# EAGLE design BCB-RECIEVER-DESGIN (EAGLE 9.3.1)
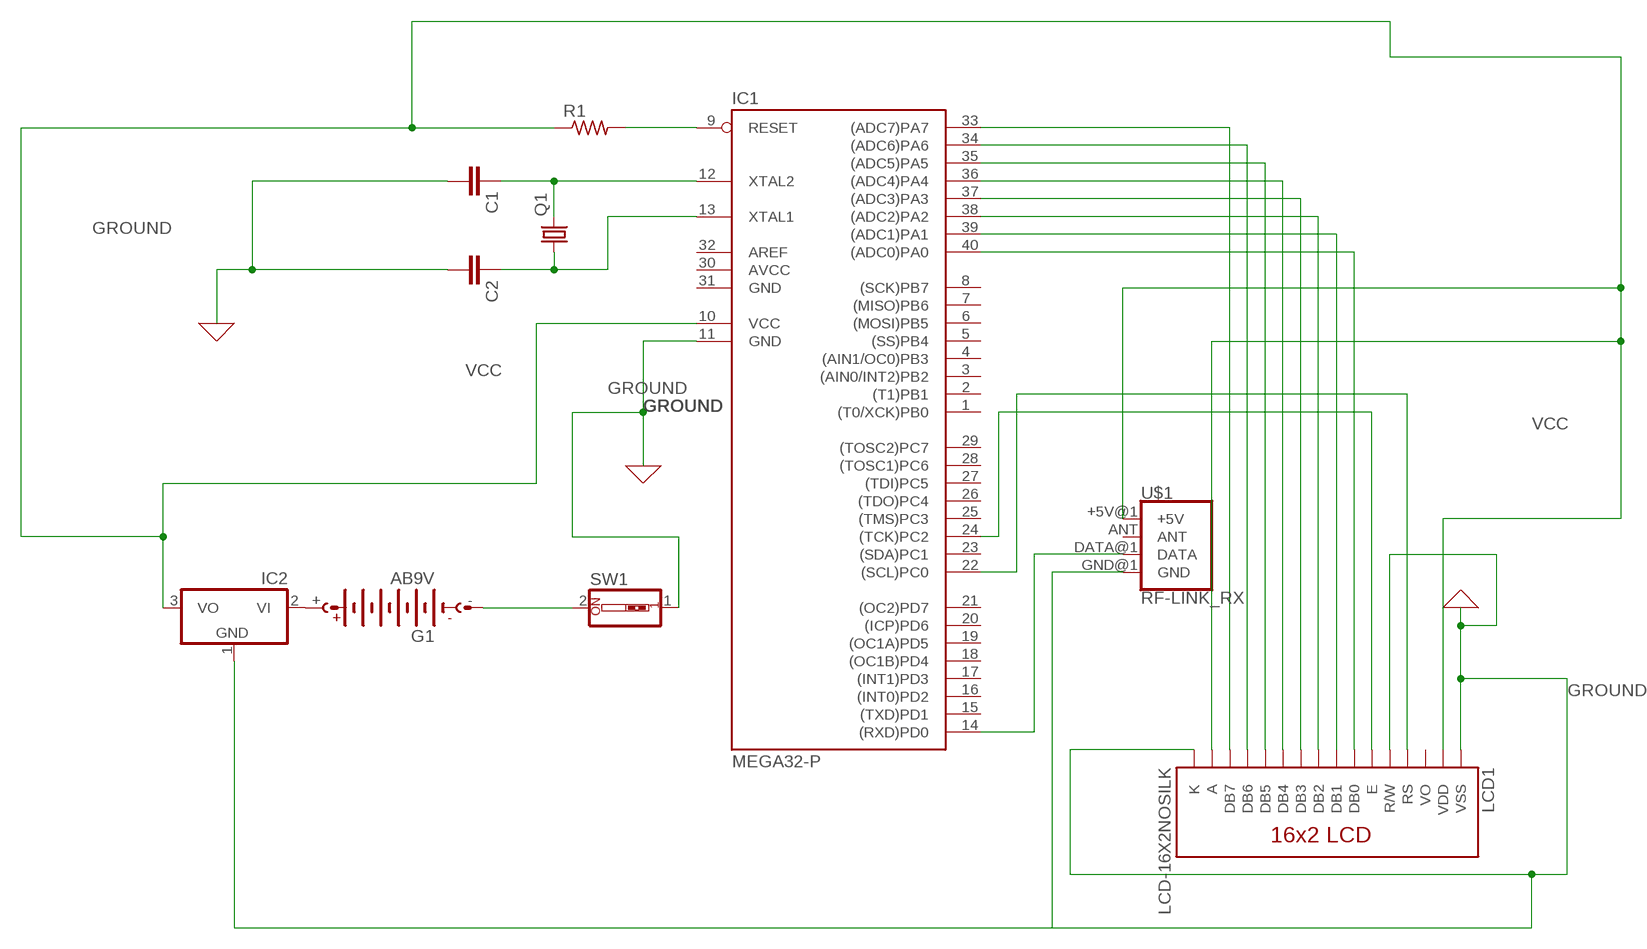
[diagram p0: schematic, sheet 1]

## Parts
C1  C5/2.5  [C5B2.5]
C2  C5/2.5  [C5B2.5]
G1  AB9V  [AB9V]
IC1  MEGA32-P  [DIL40]
IC2  7905T  [TO220H]
LCD1  LCD-16X2NOSILK  [LCD-16X2_NOSILK]
Q1  CRYSTALHC49S  [HC49/S]
R1  R-US_0207/10  [0207/10]
SW1  SW_DIP-1  [EDG-01]
U$1  RF-LINK_RX  [RF-LINK_RX]

## Nets
GROUND: C1.2 C2.2 IC1.11(GND) IC2.1(GND) LCD1.1(VSS) LCD1.5(R/W) LCD1.16(K) SW1.1 U$1.GND@1(GND) ; supply symbol labelled GND
N$1: IC1.9(RESET) R1.2
N$2: IC1.33((ADC7)PA7) LCD1.14(DB7)
N$3: IC1.34((ADC6)PA6) LCD1.13(DB6)
N$4: IC1.35((ADC5)PA5) LCD1.12(DB5)
N$5: IC1.36((ADC4)PA4) LCD1.11(DB4)
N$6: IC1.37((ADC3)PA3) LCD1.10(DB3)
N$7: IC1.38((ADC2)PA2) LCD1.9(DB2)
N$8: IC1.39((ADC1)PA1) LCD1.8(DB1)
N$9: IC1.40((ADC0)PA0) LCD1.7(DB0)
N$10: IC1.22((SCL)PC0) LCD1.4(RS)
N$11: IC1.24((TCK)PC2) LCD1.6(E)
N$13: IC1.14((RXD)PD0) U$1.DATA@1(DATA)
N$14: C2.1 IC1.13(XTAL1) Q1.1
N$15: C1.1 IC1.12(XTAL2) Q1.2
N$16: G1.+ IC2.2(VI)
N$19: G1.- SW1.2
VCC: IC1.10(VCC) IC2.3(VO) LCD1.2(VDD) LCD1.15(A) R1.1 U$1.+5V@1(+5V)
Unconnected: IC1.1((T0/XCK)PB0) IC1.2((T1)PB1) IC1.3((AIN0/INT2)PB2) IC1.4((AIN1/OC0)PB3) IC1.5((SS)PB4) IC1.6((MOSI)PB5) IC1.7((MISO)PB6) IC1.8((SCK)PB7) IC1.15((TXD)PD1) IC1.16((INT0)PD2) IC1.17((INT1)PD3) IC1.18((OC1B)PD4) IC1.19((OC1A)PD5) IC1.20((ICP)PD6) IC1.21((OC2)PD7) IC1.23((SDA)PC1) IC1.25((TMS)PC3) IC1.26((TDO)PC4) IC1.27((TDI)PC5) IC1.28((TOSC1)PC6) IC1.29((TOSC2)PC7) IC1.32(AREF) LCD1.3(VO) U$1.ANT

## Power pins joined to a net without a drawn wire
AVCC: IC1.30(AVCC)
GND: IC1.31(GND)

## Library data of the parts
C1 C2 = capacitor-wima:C: CAPACITOR naming: grid - package width
G1 = battery:AB9V: 9-V BATTERY CLIP
IC1 = atmel:MEGA32-P: MICROCONTROLLER 32 Kbytes FLASH 2 Kbytes SRAM 1 Kbytes EEPROM USART 8-channel 10 bit ADC Source: www.atmel.com .. doc2503.pdf; MPN: ATMEGA32-16PU; OC_FARNELL: 1661729; OC_NEWARK: 51P1794
IC2 = linear:79*: Negative VOLTAGE REGULATOR
LCD1 = SparkFun-Displays:LCD-16X2: Standard text-only 16x2 parallel input LCD Basic 16 character by 2 line display. Typically utilizes the extremely common HD44780 parallel interface chipset SparkFun Products: Basic 16x2 Green <https://www.sparkfun.com/products/255> Basic 8x2 Green <https://www.sparkfun.com/products/11122>; SF_ID: LCD-00255
Q1 = crystal:CRYSTAL: CRYSTAL; OC_FARNELL: 1667008; OC_NEWARK: unknown
R1 = rcl:R-US_: RESISTOR, American symbol; SPICEPREFIX: R
SW1 = special:SW_DIP-1: DIP SWITCH
U$1 = SparkFun-RF:RF-LINK_RX: RF Link Receiver (434 MHz, 315 MHz) These wireless receivers work with equivalent transmitters. They can easily fit into a breadboard and work well with microcontrollers to create a very simple wireless data link. Since these are only receivers, they will only work communicating data one-way, you would need two pairs (of different frequencies) to act as a transmitter/receiver pair.. SparkFun Products RF Link Receiver - 4800bps (434 MHz) <https://www.sparkfun.com/products/10532>(WRL-10532); SF_ID: WRL-10533

## Net classes
0 default: width 0.8 mm, drill 0.4 mm, clearance 0.6 mm

## Board
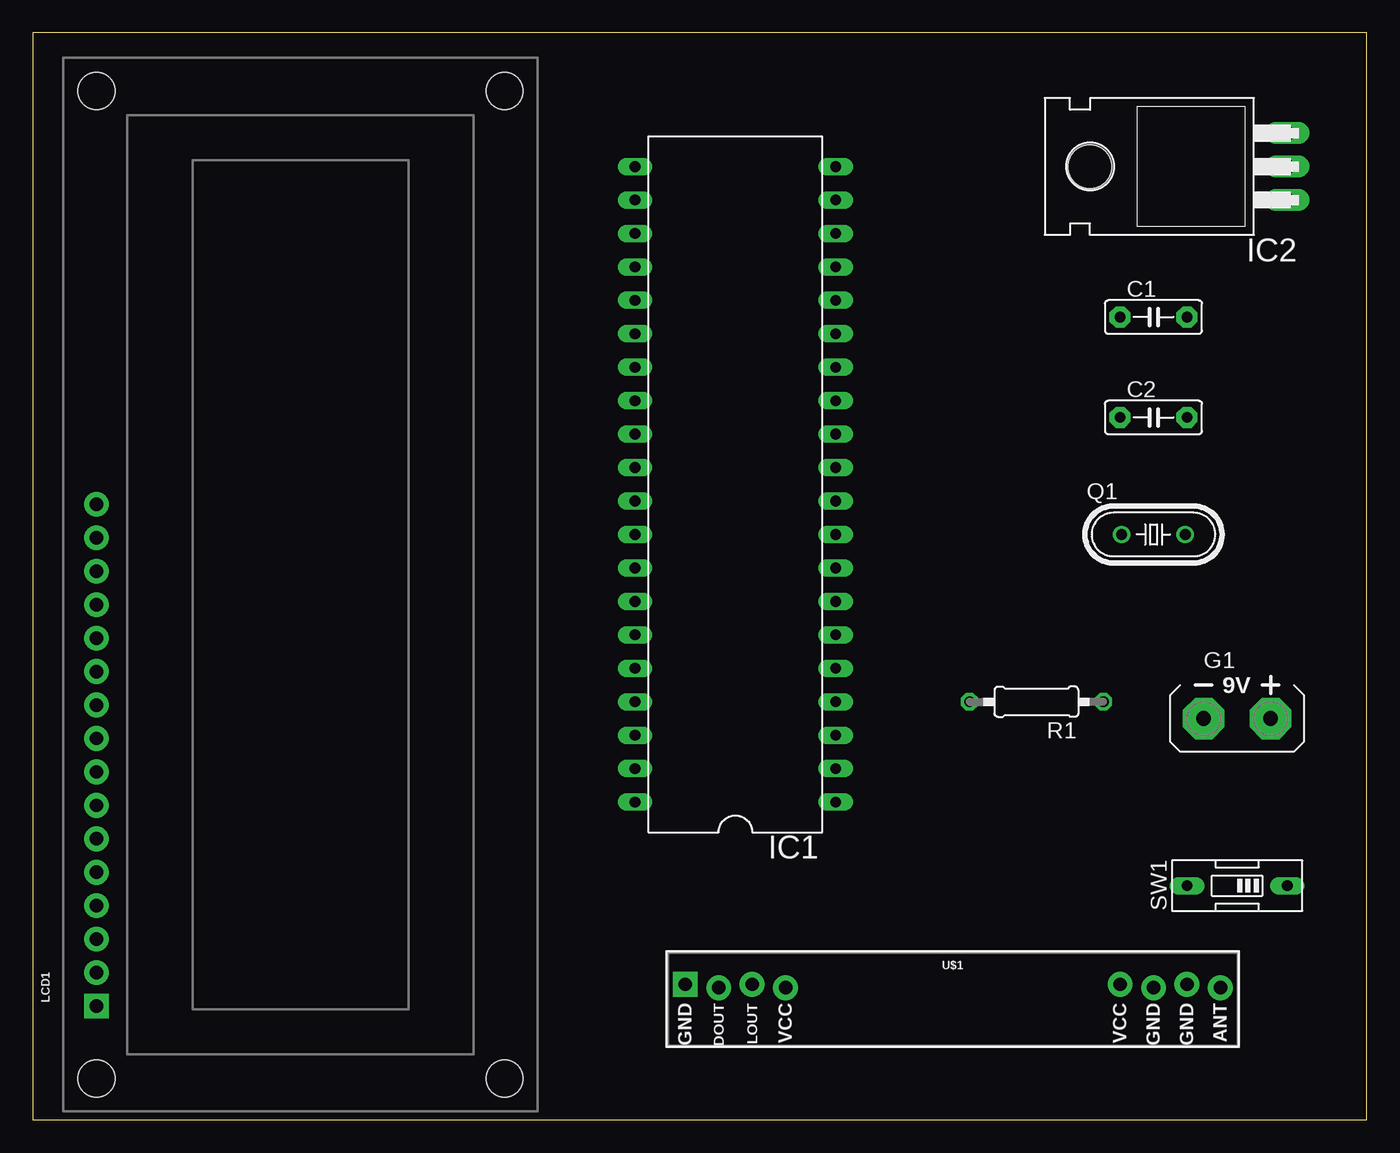
[diagram p1: board, top side]
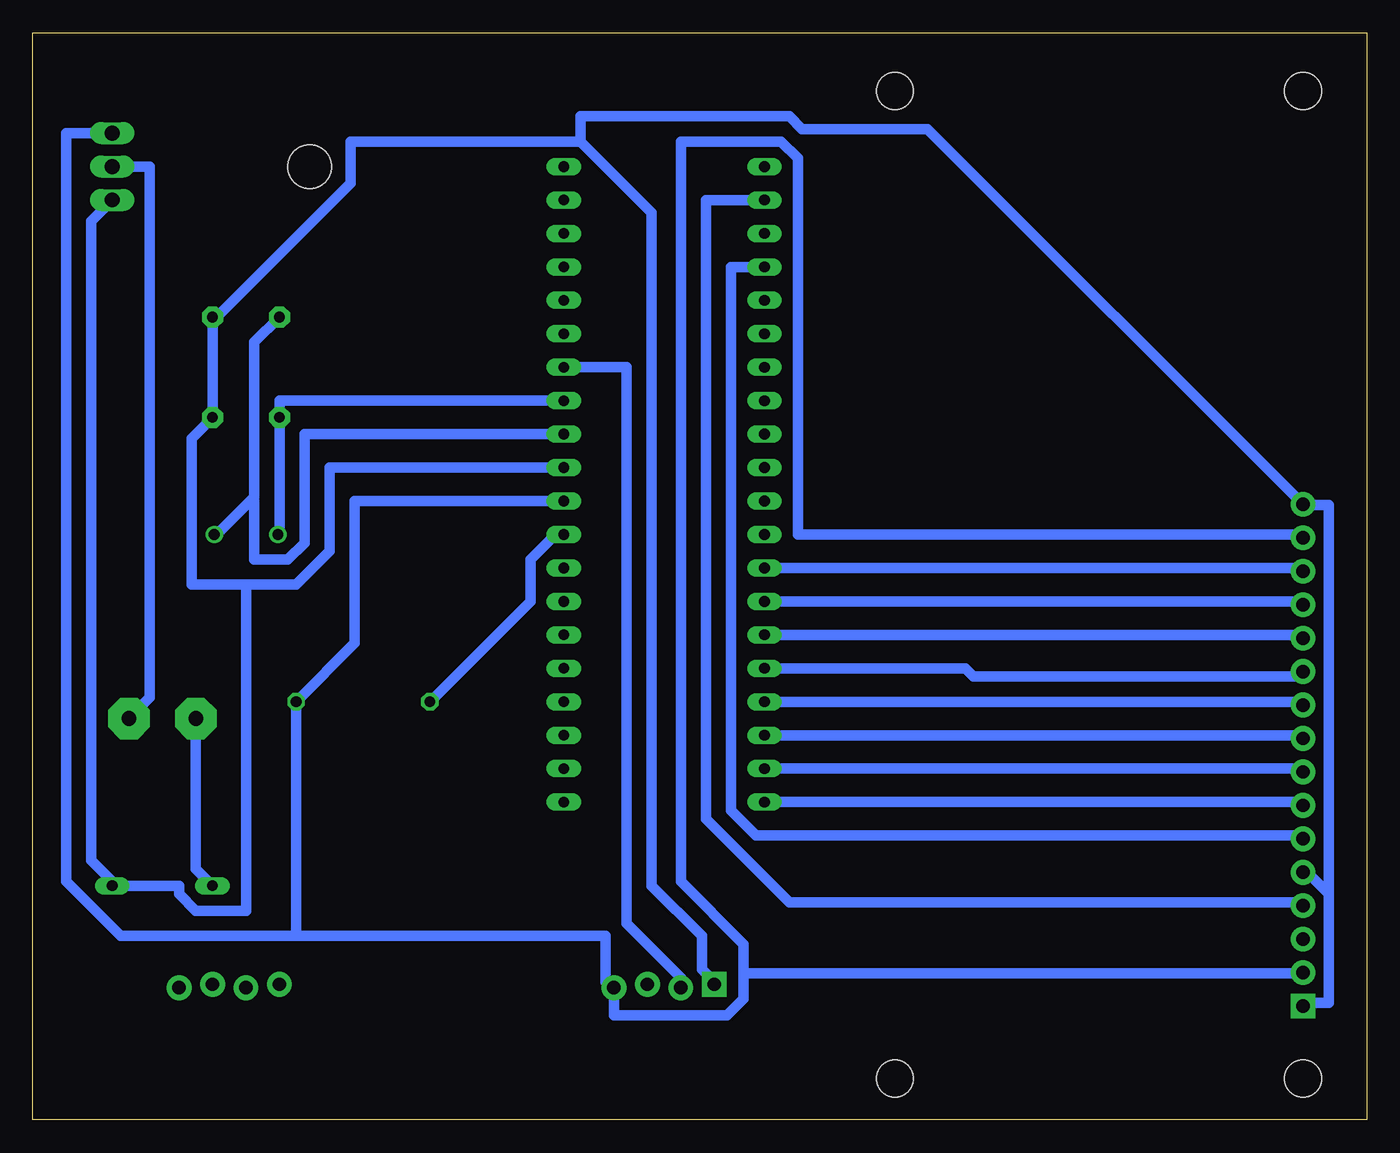
[diagram p2: board, bottom side, seen from below]

Size 101.27 x 82.54 mm. Coordinates in mm from the lower left corner, seen from the top.
Outline: 0,0 101.27,0 101.27,82.54 0,82.54 0,0
Copper layers (1*16): Top 0.035mm / dielectric 1.5mm / Bottom 0.035mm
Design rules "default *": minimum track width 0.8mm, minimum drill 0.6mm, track to track 0.8mm, track to pad 0.4mm, pad to pad 6mil, via to via 6mil, smd to smd 6mil, copper to edge 40mil, drill to drill 6mil, minimum pad ring 10mil, minimum via ring 8mil, stop-mask expansion 4mil, vias tented up to drill 0mil, thermal gap 10mil

### Footprints (pad centres in the part's own frame; a part is rotated, then mirrored left to right if it is on the bottom)
C5B2.5 = drill 0.813 pad 1.6 octagon: 1 -2.54,0; 2 2.54,0
AB9V = drill 1.118 pad 3.15 octagon: + 0,2.54; - 0,-2.54
DIL40 = drill 0.813 long: 1 -24.13,-7.62; 2 -21.59,-7.62; 3 -19.05,-7.62; 4 -16.51,-7.62; 5 -13.97,-7.62; 6 -11.43,-7.62; 7 -8.89,-7.62; 8 -6.35,-7.62; 9 -3.81,-7.62; 10 -1.27,-7.62; 11 1.27,-7.62; 12 3.81,-7.62; 13 6.35,-7.62; 14 8.89,-7.62; 15 11.43,-7.62; 16 13.97,-7.62; 17 16.51,-7.62; 18 19.05,-7.62; 19 21.59,-7.62; 20 24.13,-7.62; 21 24.13,7.62; 22 21.59,7.62; 23 19.05,7.62; 24 16.51,7.62; 25 13.97,7.62; 26 11.43,7.62; 27 8.89,7.62; 28 6.35,7.62; 29 3.81,7.62; 30 1.27,7.62; 31 -1.27,7.62; 32 -3.81,7.62; 33 -6.35,7.62; 34 -8.89,7.62; 35 -11.43,7.62; 36 -13.97,7.62; 37 -16.51,7.62; 38 -19.05,7.62; 39 -21.59,7.62; 40 -24.13,7.62
TO220H = drill 1.118 long: 1 -2.54,-10.16; 2 0,-10.16; 3 2.54,-10.16 | hole 3.302: 0,4.826
LCD-16X2_NOSILK = drill 1.016 pad 1.88 square: 1 -32,15.5 | drill 1.016 pad 1.88: 2 -29.46,15.5; 3 -26.92,15.5; 4 -24.38,15.5; 5 -21.84,15.5; 6 -19.3,15.5; 7 -16.76,15.5; 8 -14.22,15.5; 9 -11.68,15.5; 10 -9.14,15.5; 11 -6.6,15.5; 12 -4.06,15.5; 13 -1.52,15.5; 14 1.02,15.5; 15 3.56,15.5; 16 6.1,15.5 | hole 2.8: -37.5,15.5; -37.5,-15.5; 37.5,15.5; 37.5,-15.5
HC49/S = drill 0.813: 1 -2.413,0; 2 2.413,0
0207/10 = drill 0.813 octagon: 1 -5.08,0; 2 5.08,0
EDG-01 = drill 0.813 long: 1 0,-3.81; 2 0,3.81
RF-LINK_RX = drill 1.016 pad 1.88: +5V@1 -12.7,-0.127; +5V@2 12.7,0.127; ANT 20.32,-0.127; DATA@1 -17.78,-0.127; DATA@2 -15.24,0.127; GND@2 15.24,-0.127; GND@3 17.78,0.127 | drill 1.016 pad 1.88 square: GND@1 -20.32,0.127

### Placement (x,y rotation side)
C1  85.09,60.96 0 top
C2  85.09,53.34 0 top
G1  91.44,30.48 270 top
IC1  53.34,48.26 90 top
IC2  85.09,72.39 90 top
LCD1  20.32,40.64 90 top
Q1  85.09,44.45 0 top
R1  76.2,31.75 180 top
SW1  91.44,17.78 90 top
U$1  69.85,10.16 0 top

### Tracks (layer width: path | path; a pad name or v marks a point on that pad's centre or on a via)
GROUND
  Bottom 0.8: 2.86,17.14 2.86,8.89 4.76,8.89 LCD1.1 | 2.86,17.14 4.76,19.05 LCD1.5 | 2.86,17.14 2.86,46.67 4.76,46.67 LCD1.16 5.08,46.99 33.34,75.25 42.86,75.25 43.82,76.2 59.69,76.2 59.69,74.3 | IC1.11 78.74,49.53 78.74,43.18 81.28,40.64 85.09,40.64 | 85.09,40.64 89.22,40.64 89.22,51.75 C2.2 C1.2 87.31,60.96 77.15,71.12 77.15,74.3 59.69,74.3 | 85.09,40.64 85.09,15.88 88.9,15.88 90.17,17.14 90.17,17.78 SW1.1 95.25,18.1 96.84,19.68 96.84,68.26 IC2.1 | 59.69,74.3 54.29,68.9 54.29,17.78 50.48,13.97 50.48,11.43 49.53,10.48 U$1.GND@1
N$1
  Bottom 0.8: R1.2 63.5,39.37 63.5,42.55 61.6,44.45 IC1.9
N$2
  Bottom 0.8: IC1.33 5.08,41.91 LCD1.14
N$3
  Bottom 0.8: IC1.34 5.08,39.37 LCD1.13
N$4
  Bottom 0.8: IC1.35 5.08,36.83 LCD1.12
N$5
  Bottom 0.8: IC1.36 30.48,34.29 29.84,33.66 5.08,33.66 5.08,33.97 LCD1.11
N$6
  Bottom 0.8: IC1.37 5.08,31.75 LCD1.10
N$7
  Bottom 0.8: IC1.38 5.08,29.21 LCD1.9
N$8
  Bottom 0.8: IC1.39 5.08,26.67 LCD1.8
N$9
  Bottom 0.8: IC1.40 5.08,24.13 LCD1.7
N$10
  Bottom 0.8: IC1.22 50.17,69.85 50.17,22.86 43.82,16.51 5.08,16.51 LCD1.4
N$11
  Bottom 0.8: IC1.24 48.26,64.77 48.26,23.5 46.36,21.59 5.08,21.59 LCD1.6
N$13
  Bottom 0.8: IC1.14 56.2,57.15 56.2,14.92 52.07,10.79 U$1.DATA@1
N$14
  Bottom 0.8: IC1.13 82.55,54.61 C2.1 82.55,44.45 Q1.1
N$15
  Bottom 0.8: 84.61,47.15 84.45,47.31 84.45,59.05 C1.1 | 84.61,47.15 87.31,44.45 Q1.2 | IC1.12 80.64,52.07 80.64,43.81 81.91,42.55 84.45,42.55 84.45,46.99 84.61,47.15
N$16
  Bottom 0.8: IC2.2 92.39,72.39 92.39,32.07 G1.+
N$19
  Bottom 0.8: SW1.2 88.9,19.05 G1.-
VCC
  Bottom 0.8: IC1.10 76.83,46.99 76.83,36.2 R1.1 81.28,13.97 | IC2.3 98.74,74.93 98.74,18.1 94.61,13.97 81.28,13.97 | 47.31,11.11 5.08,11.11 LCD1.2 | 47.31,11.11 47.31,9.21 48.58,7.94 57.15,7.94 U$1.+5V@1 57.47,10.16 57.79,10.48 57.79,13.97 81.28,13.97 | 47.31,11.11 47.31,13.34 52.07,18.1 52.07,74.3 44.45,74.3 43.18,73.03 43.18,44.45 5.08,44.45 LCD1.15